# EasyEDA Pro project VFD-BOE1002B-PY32_LCEDA-PRO.epro

# Schematic Schematic1

## Sheets
1 VFD-Driver: Create Date: 2024-07-08; Page Name: VFD-Driver; Project Name: VFD-BOE1002B-PY32; Schematic Name: Schematic1; Update Date: 2024-07-08; Company: 嘉立创EDA; Page Size: A4; Version: V1.0
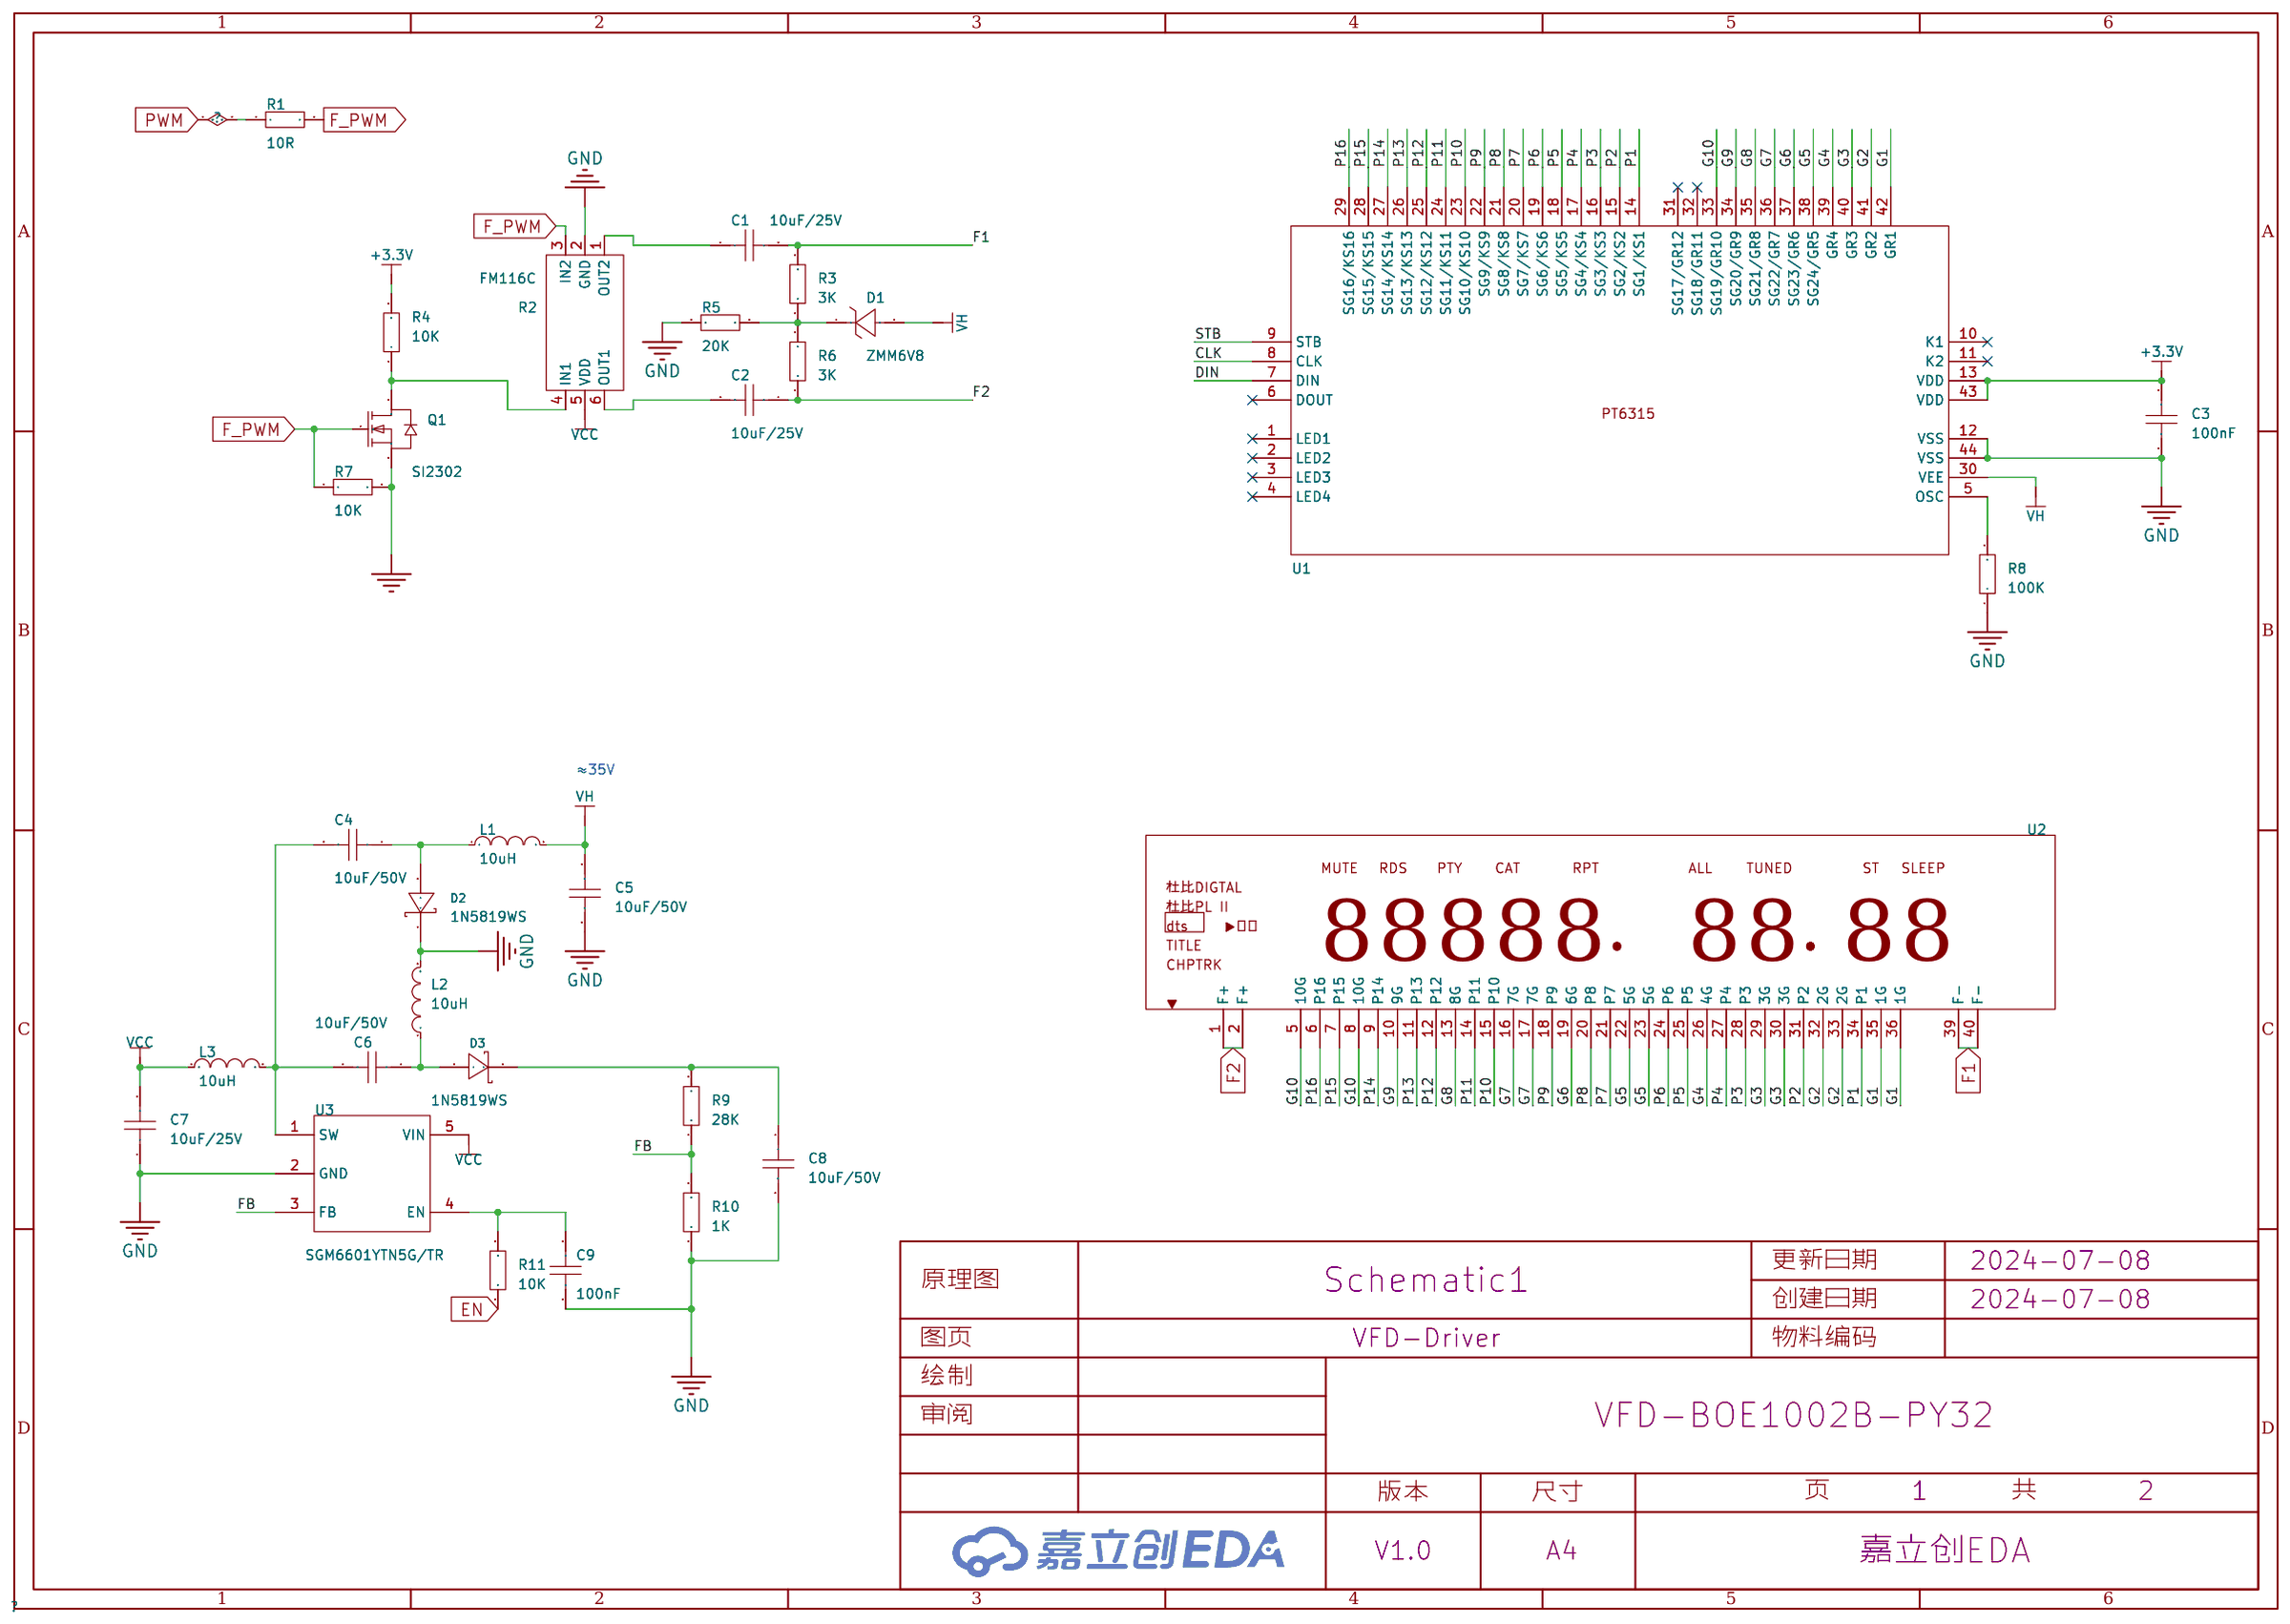
[diagram p0: VFD-Driver]
2 MCU: Page Name: MCU
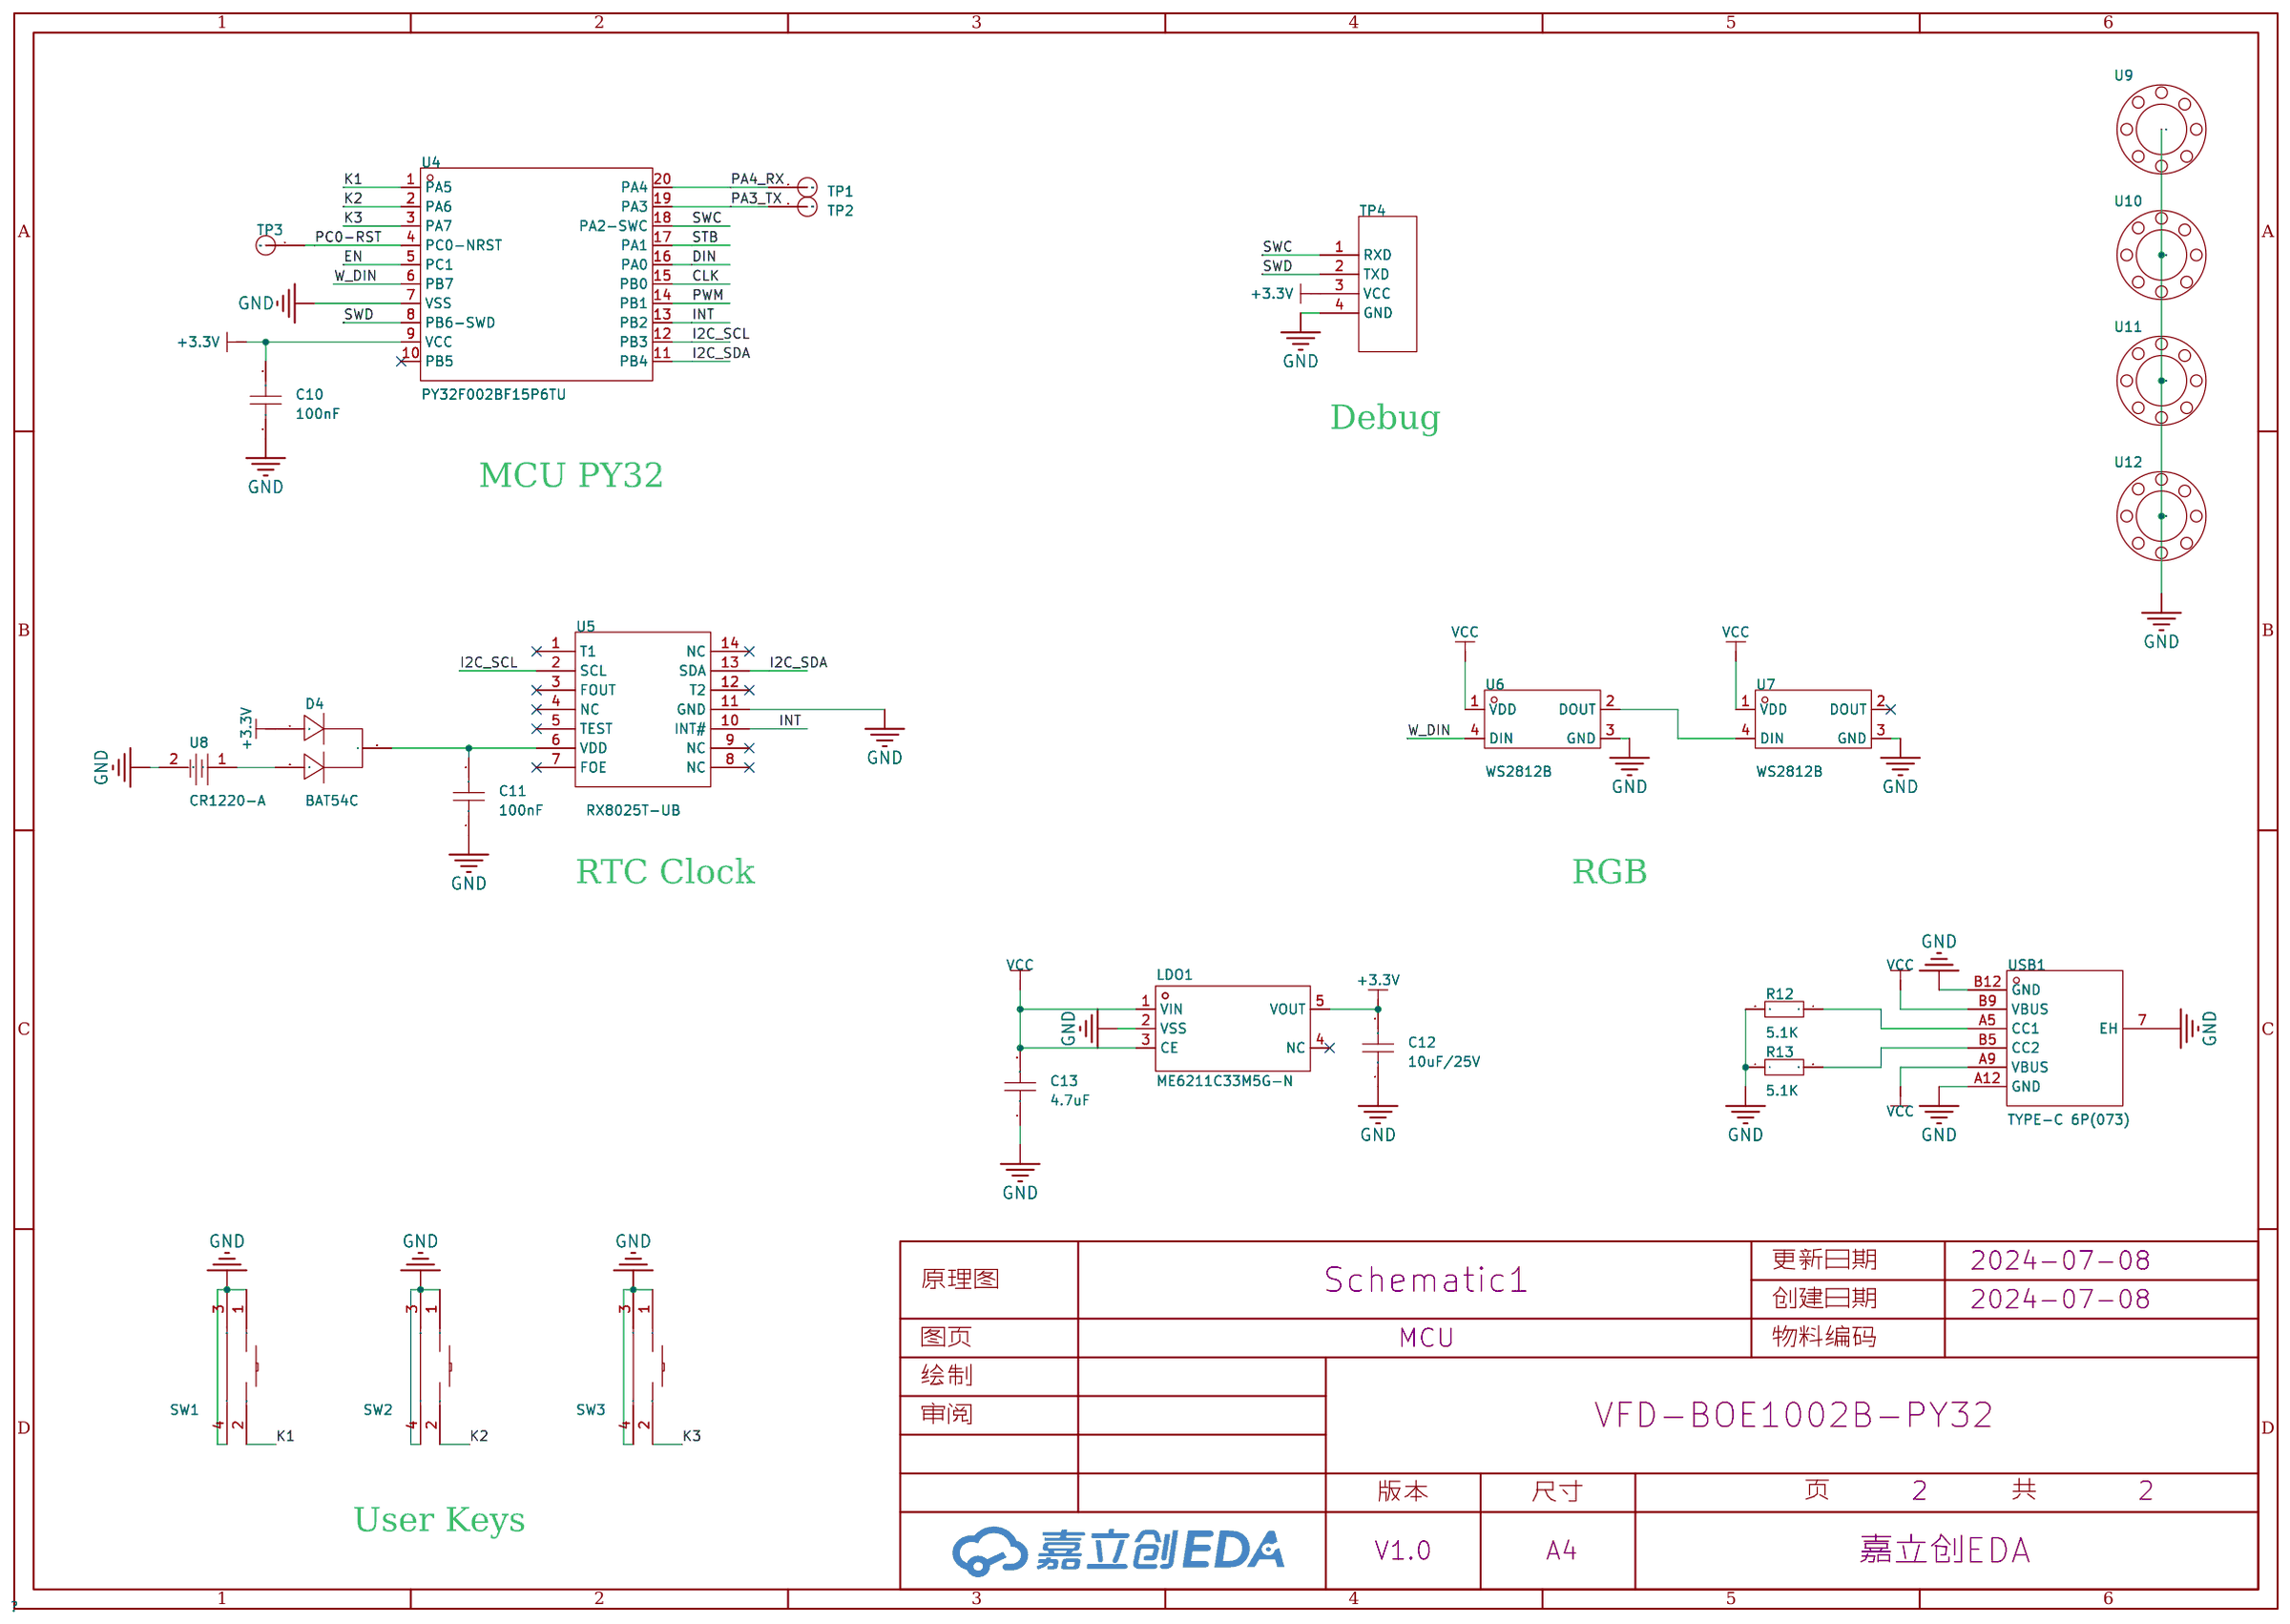
[diagram p1: MCU]

## Parts
sheet MCU
C10  100nF  [C0603]
C11  100nF  [C0603]
C12  10uF/25V  [C0805]
C13  4.7uF  [C0805]
D4  BAT54C  [SOT-23-3_L2.9-W1.3-P1.90-LS2.4-BR]
LDO1  ME6211C33M5G-N  [SOT-23-5_L3.0-W1.7-P0.95-LS2.8-BL]
R12  5.1K  [R0603]
R13  5.1K  [R0603]
SW1  K2-1806SA-A3DW-04  [KEY-SMD_K2-1806SA-AXXW-XX]
SW2  K2-1806SA-A3DW-04  [KEY-SMD_K2-1806SA-AXXW-XX]
SW3  K2-1806SA-A3DW-04  [KEY-SMD_K2-1806SA-AXXW-XX]
TP1  测试点  [TESTPAD]
TP2  测试点  [TESTPAD]
TP3  测试点  [TESTPAD]
TP4  -  [UART测试点]
U4  PY32F002BF15P6TU  [TSSOP-20_L6.5-W4.4-P0.65-LS6.4-BL]
U5  RX8025T-UB  [SOIC-14_L10.1-W5.0-P1.27-LS7.4-BL]
U6  WS2812B  [LED-SMD_4P-L2.0-W1.8-TL]
U7  WS2812B  [LED-SMD_4P-L2.0-W1.8-TL]
U8  CR1220-A  [BAT-SMD_CR1220-2]
U9  -  [M2螺丝孔]
U10  -  [M2螺丝孔]
U11  -  [M2螺丝孔]
U12  -  [M2螺丝孔]
USB1  TYPE-C 6P(073)  [TYPE-C-SMD_TYPE-C-6P]
sheet VFD-Driver
C1  10uF/25V  [C0805]
C2  10uF/25V  [C0805]
C3  100nF  [C0603]
C4  10uF/50V  [C0805]
C5  10uF/50V  [C0805]
C6  10uF/50V  [C0805]
C7  10uF/25V  [C0805]
C8  10uF/50V  [C0805]
C9  100nF  [C0603]
D1  ZMM6V8  [LL-34_L3.5-W1.5-RD]
D2  1N5819WS  [SOD-323_L1.8-W1.3-LS2.5-RD]
D3  1N5819WS  [SOD-323_L1.8-W1.3-LS2.5-RD]
L1  10uH  [IND-SMD_L3.0-W3.0-1]
L2  10uH  [IND-SMD_L3.0-W3.0-1]
L3  10uH  [IND-SMD_L3.0-W3.0-1]
Q1  SI2302  [SOT-23-3_L2.9-W1.3-P1.90-LS2.4-BR]
R1  10R  [R0603]
R2  FM116C  [SOT-23-6_L2.9-W1.6-P0.95-LS2.9-BL]
R3  3K  [R0603]
R4  10K  [R0603]
R5  20K  [R0603]
R6  3K  [R0603]
R7  10K  [R0603]
R8  100K  [R0603]
R9  28K  [R0603]
R10  1K  [R0603]
R11  10K  [R0603]
U1  -  [LQFP-PT6315]
U2  -  [BOE-VFD16-1002B]
U3  SGM6601YTN5G/TR  [SOT-23-5_L3.0-W1.7-P0.95-LS2.8-BR]

## Library data of the parts
C3 C9-C11 = CAP_0603: Supplier Footprint: 0603
C1 C2 C4-C8 C12 C13 = CAP_0805: Supplier Footprint: 0805
D4 = BAT54C: Supplier Part: C9900013520; Supplier Footprint: SOT-23; JLCPCB Part Class: 扩展库; Supplier: LCSC
LDO1 = ME6211C33M5G-N: 输出类型:固定;输出极性:正;最大输入电压:6V;输出电压:3.3V;输出电流:500mA;电源纹波抑制比(PSRR):70dB;; Supplier Part: C82942; Manufacturer: MICRONE(南京微盟); Supplier Footprint: SOT-23-5; JLCPCB Part Class: 扩展库; Datasheet: https://atta.szlcsc.com/upload/public/pdf/source/20170918/C82942_1505727073070976520.pdf; Supplier: LCSC; Output Type: 固定; Maximum Input Voltage: 6V; Output Voltage: 3.3V; MAX Output Current: 500mA; Power Supply Rejection Ratio (PSRR): 70dB; Dropout Voltage: 260mV@(200mA); Output Polarity: 正; Number of Outputs: 1; Output Current: 500mA
R1 R3-R13 = Res_0603: Supplier Footprint: 0603
SW1-SW3 = K2-1806SA-A3DW-04: 触点电流:50mA;额定电压(DC):12V;绝缘电阻:100MΩ;安装方式:卧贴;作用力:180gf@±30gf;机械寿命:100000;工作温度:-25℃~+85℃;开关长度:4.8mm;开关宽度:3.55mm;开关高度:1.88mm;; LCSC Part Name: 2x4 小型侧按键 160G; Supplier Part: C2690015; Manufacturer: 韩国韩荣; Supplier Footprint: SMD; JLCPCB Part Class: 扩展库; Datasheet: https://atta.szlcsc.com/upload/public/pdf/source/20201126/C961746_BE85072586CFEF659A466A854D742287.pdf; Supplier: LCSC; Contact Current: 50mA; Voltage Rating (DC): 12V; Insulation Resistance: 100MΩ; Mounting Sytle: 卧贴; Operating Force: 180gf@±30gf; Mechanical Life: 100000; Operating Temperature: -25℃~+85℃; Switch Length: 4.8mm; Switch Width: 3.55mm; Switch Height: 1.88mm
TP1-TP3 = 测试点
TP4 = UART测试点
U4 = PY32F002BF15P6TU: Supplier Part: C7469098; Manufacturer: PUYA(普冉); Supplier Footprint: TSSOP-20; JLCPCB Part Class: 扩展库; Datasheet: https://atta.szlcsc.com/upload/public/pdf/source/20230721/558A839BF110561168DB9B6F0054F7DC.pdf; Supplier: LCSC
U5 = RX8025T-UB: 接口:I2C;工作电压:1.8V~5.5V;; LCSC Part Name: RX8025T-UB(X1B000281000400); Supplier Part: C17353; Manufacturer: EPSON(爱普生); Supplier Footprint: SOP-14-208mil; JLCPCB Part Class: 扩展库; Datasheet: https://atta.szlcsc.com/upload/public/pdf/source/20220803/150C0D1072734F0C199E626251B601D2.pdf; Supplier: LCSC; Interface: I2C; Operating Voltage: 1.8V~5.5V
U6 U7 = WS2812B: Supplier Part: C9900011976; Supplier Footprint: SMD-0807; JLCPCB Part Class: 扩展库; Supplier: LCSC
U8 = CR1220-A: Supplier Part: C9900016718; Supplier Footprint: SMD-2P; JLCPCB Part Class: 扩展库; Supplier: LCSC
U9-U12 = M2螺丝孔: _: 3
USB1 = TYPE-C 6P(073): 连接器类型:Type-C;标准:-;公母:母;端口数量:1;触点数量:6P;安装方式:卧贴;额定电流 - 电源:5A;工作温度范围:-25℃~+85℃;; LCSC Part Name: Type-C 母 卧贴; Supplier Part: C668623; Manufacturer: SHOU HAN(首韩); Supplier Footprint: SMD; JLCPCB Part Class: 扩展库; Datasheet: https://atta.szlcsc.com/upload/public/pdf/source/20200618/C668623_A4B260DED7AC1949BAC6AE39E9F4CD80.pdf; Supplier: LCSC; Connector Type: Type-C; Gender: 母; Number of Ports: 1; Number of Contacts: 6P; Mounting Style: 卧贴; Current Rating - Power (Max): 5A; Operating Temperature Range: -25℃~+85℃
D1 = ZMM6V8: 稳压值(标称值):-;精度:-;功率:500mW;反向电流(Ir):100nA@3V;; LCSC Part Name: 500mW; Supplier Part: C707197; Manufacturer: Slkor(萨科微); Supplier Footprint: LL-34; JLCPCB Part Class: 扩展库; Datasheet: https://atta.szlcsc.com/upload/public/pdf/source/20200721/C707184_776B95022AAA01ECB528B9CFDAFDB27C.pdf; Supplier: LCSC; Power Dissipation: 500mW; Reverse Leakage Current (Ir): 100nA@3V
D2 D3 = 1N5819WS_C191023: 直流反向耐压(Vr):40V;平均整流电流(Io):1A;正向压降(Vf):600mV@1A;; LCSC Part Name: 40V 1A 600mV@1A; Supplier Part: C191023; Manufacturer: Hottech(合科泰); Supplier Footprint: SOD-323; JLCPCB Part Class: 基础库; Datasheet: https://atta.szlcsc.com/upload/public/pdf/source/20220428/3CB86FD8D28D653594B4E35F9D5AEFD9.pdf; Supplier: LCSC; Reverse Voltage (Vr): 40V; Average Rectified Current (Io): 1A; Forward Voltage (Vf@If): 600mV@1A
L1-L3 = YNR3015-100M: 电感值:10uH;精度:±20%;额定电流:720mA;; LCSC Part Name: 10uH ±20% 720mA 250mΩ; Supplier Part: C340363; Manufacturer: YJYCOIN(益嘉源); Supplier Footprint: SMD,3x3x1.5mm; JLCPCB Part Class: 扩展库; Datasheet: https://atta.szlcsc.com/upload/public/pdf/source/20200623/C340358_C27839FA2B30CE868341344736623AD1.pdf; Supplier: LCSC; Tolerance: ±20%; Rated Current: 720mA; DC Resistance (DCR): 250mΩ
Q1 = SI2302: 类型:N沟道;漏源电压(Vdss):20V;连续漏极电流(Id):2.6A;功率(Pd):900mW;导通电阻(RDS(on)@Vgs,Id):85mΩ@4.5V,2.6A;阈值电压(Vgs(th)@Id):1.5V@250uA;栅极电荷(Qg@Vgs):-;输入电容(Ciss@Vds):880pF@6V;反向传输电容(Crss@Vds):-;工作温度:+150℃@(Tj);; LCSC Part Name: N沟道 20V 2.6A; Supplier Part: C2841377; Manufacturer: TECH PUBLIC(台舟); Supplier Footprint: SOT-23-3; JLCPCB Part Class: 扩展库; Datasheet: https://atta.szlcsc.com/upload/public/pdf/source/20210810/B45106B571BB908B9120BCB1C1283335.pdf; Supplier: LCSC; Type: N沟道; Drain Source Voltage (Vdss): 20V; Continuous Drain Current (Id): 2.6A; Power Dissipation (Pd): 900mW; Drain Source On Resistance (RDS(on)@Vgs,Id): 85mΩ@4.5V,2.6A; Gate Threshold Voltage (Vgs(th)@Id): 1.5V@250uA; Input Capacitance (Ciss@Vds): 880pF@6V; Operating Temperature: +150℃@(Tj)
R2 = FM116C: Supplier Part: C2802264; Manufacturer: FM(富满); Supplier Footprint: SOT-23-6; JLCPCB Part Class: 扩展库; Datasheet: https://atta.szlcsc.com/upload/public/pdf/source/20210409/C2802264_450FE4C4150541706D06339CE4C8D159.pdf; Supplier: LCSC
U1 = PT6315
U2 = BOE-VFD16-1002B: VFD屏幕(DesignBy Saisaiwa)
U3 = SGM6601YTN5G/TR: 功能类型:升压型;同步整流:-;输出通道数:1;拓扑结构:升压式;输入电压:1.8V~6V;输出电压:38V;输出电流(最大值):400mA;开关频率:1MHz;; LCSC Part Name: 升压型 Vin=1.8V~6V Vout=38V 400mA; Supplier Part: C84574; Manufacturer: SGMICRO(圣邦微); Supplier Footprint: SOT-23-5; JLCPCB Part Class: 扩展库; Datasheet: https://atta.szlcsc.com/upload/public/pdf/source/20170510/1494407693659.pdf; Supplier: LCSC; Function: 升压型; Number of Outputs: 1; Topology: 升压式; Input Voltage: 1.8V~6V; Output Voltage: 38V; Output Current (Max): 400mA; Switching Frequency: 1MHz

## Nets
+3.3V: C3.2 C10.2 C12.2 D4.1(A1) LDO1.5(VOUT) R4.2 TP4.3(VCC) U1.13(VDD) U1.43(VDD) U4.9(VCC)
GND: C3.1 C5.2 C7.1 C8.2 C9.1 C10.1 C11.1 C12.1 C13.1 D2.1(K) L2.2 LDO1.2(VSS) Q1.2(S) R2.2(GND) R5.1 R7.2 R8.1 R10.1 R12.2 R13.1 SW1.1 SW1.3 SW1.4 SW2.1 SW2.3 SW2.4 SW3.1 SW3.3 SW3.4 TP4.4(GND) U1.12(VSS) U1.44(VSS) U3.2(GND) U4.7(VSS) U5.11(GND) U6.3(GND) U7.3(GND) U8.2 U9.1 U10.1 U11.1 U12.1 USB1.7(EH) USB1.A12(GND) USB1.B12(GND)
VCC: C7.2 C13.2 L3.1 LDO1.1(VIN) LDO1.3(CE) R2.5(VDD) U3.5(VIN) U6.1(VDD) U7.1(VDD) USB1.A9(VBUS) USB1.B9(VBUS)
CLK: U1.8(CLK) U4.15(PB0)
DIN: U1.7(DIN) U4.16(PA0)
EN: R11.1 U4.5(PC1)
F1: C1.2 R3.2 U2.39(F-) U2.40(F-)
F2: C2.1 R6.1 U2.1(F+) U2.2(F+)
F_PWM: Q1.1(G) R1.2 R2.3(IN2) R7.1
FB: R9.1 R10.2 U3.3(FB)
G1: U1.42(GR1) U2.35(1G) U2.36(1G)
G2: U1.41(GR2) U2.32(2G) U2.33(2G)
G3: U1.40(GR3) U2.29(3G) U2.30(3G)
G4: U1.39(GR4) U2.26(4G)
G5: U1.38(SG24/GR5) U2.22(5G) U2.23(5G)
G6: U1.37(SG23/GR6) U2.19(6G)
G7: U1.36(SG22/GR7) U2.16(7G) U2.17(7G)
G8: U1.35(SG21/GR8) U2.13(8G)
G9: U1.34(SG20/GR9) U2.10(9G)
G10: U1.33(SG19/GR10) U2.5(10G) U2.8(10G)
I2C_SCL: U4.12(PB3) U5.2(SCL)
I2C_SDA: U4.11(PB4) U5.13(SDA)
INT: U4.13(PB2) U5.10(INT#)
K1: SW1.2 U4.1(PA5)
K2: SW2.2 U4.2(PA6)
K3: SW3.2 U4.3(PA7)
P1: U1.14(SG1/KS1) U2.34(P1)
P2: U1.15(SG2/KS2) U2.31(P2)
P3: U1.16(SG3/KS3) U2.28(P3)
P4: U1.17(SG4/KS4) U2.27(P4)
P5: U1.18(SG5/KS5) U2.25(P5)
P6: U1.19(SG6/KS6) U2.24(P6)
P7: U1.20(SG7/KS7) U2.21(P7)
P8: U1.21(SG8/KS8) U2.20(P8)
P9: U1.22(SG9/KS9) U2.18(P9)
P10: U1.23(SG10/KS10) U2.15(P10)
P11: U1.24(SG11/KS11) U2.14(P11)
P12: U1.25(SG12/KS12) U2.12(P12)
P13: U1.26(SG13/KS13) U2.11(P13)
P14: U1.27(SG14/KS14) U2.9(P14)
P15: U1.28(SG15/KS15) U2.7(P15)
P16: U1.29(SG16/KS16) U2.6(P16)
PA3_TX: TP2.1(TESTPAD) U4.19(PA3)
PA4_RX: TP1.1(TESTPAD) U4.20(PA4)
PC0-RST: TP3.1(TESTPAD) U4.4(PC0-NRST)
PWM: R1.1 U4.14(PB1)
STB: U1.9(STB) U4.17(PA1)
SWC: TP4.1(RXD) U4.18(PA2-SWC)
SWD: TP4.2(TXD) U4.8(PB6-SWD)
VH: C5.1 D1.2(A) L1.2 U1.30(VEE)
W_DIN: U4.6(PB7) U6.4(DIN)
$1N1295: R8.2 U1.5(OSC)
$1N1298: D1.1(K) R3.1 R5.2 R6.2
$1N1304: C1.1 R2.1(OUT2)
$1N1305: C2.2 R2.6(OUT1)
$1N1312: Q1.3(D) R2.4(IN1) R4.1
$1N1316: C6.1 D3.2(A) L2.1
$1N1320: C4.1 D2.2(A) L1.1
$1N1321: C4.2 C6.2 L3.2 U3.1(SW)
$1N1324: C8.1 D3.1(K) R9.2
$1N1595: C9.2 R11.2 U3.4(EN)
$2N726: R12.1 USB1.A5(CC1)
$2N727: R13.2 USB1.B5(CC2)
$2N1396: C11.2 D4.3(K) U5.6(VDD)
$2N1397: D4.2(A2) U8.1
$2N1576: U6.2(DOUT) U7.4(DIN)

Not connected (* = marked no-connect by the designer): LDO1 4(NC)*; U1 1(LED1)* 2(LED2)* 3(LED3)* 4(LED4)* 6(DOUT)* 10(K1)* 11(K2)* 31(SG17/GR12)* 32(SG18/GR11)*; U4 10(PB5)*; U5 1(T1)* 3(FOUT)* 4(NC)* 5(TEST)* 7(FOE)* 8(NC)* 9(NC)* 12(T2)* 14(NC)*; U7 2(DOUT)*

## Notes on the sheets
sheet 1
- ≈35V
sheet 2
- Debug
- MCU PY32
- RTC Clock
- RGB
- User Keys

# Board PCB1
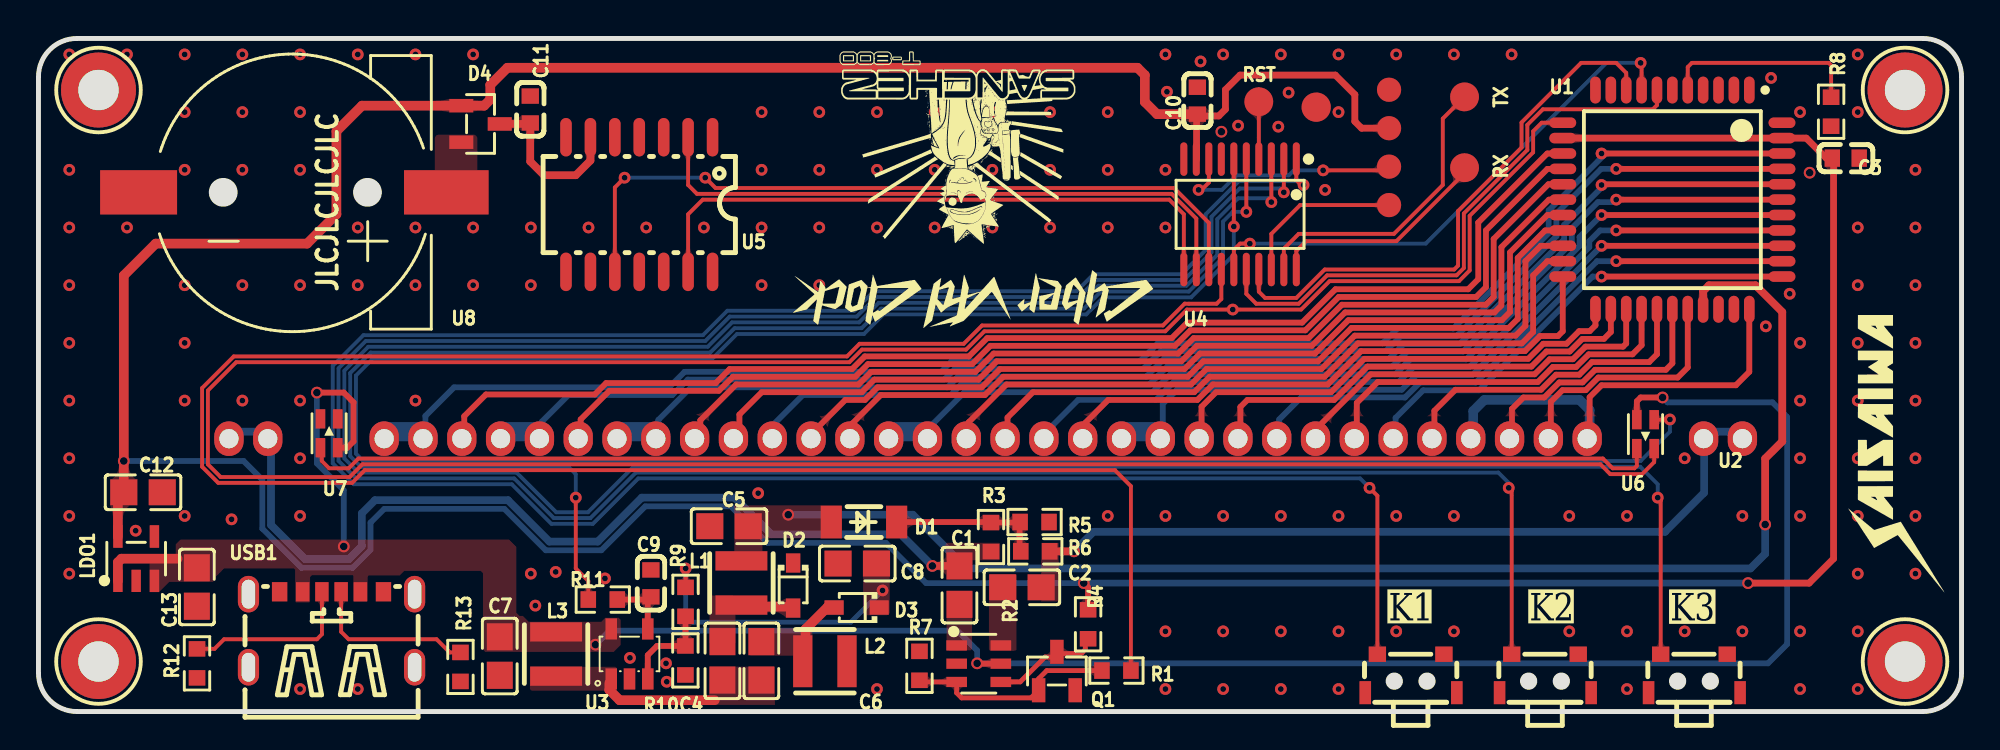
[diagram p2: board, top side]
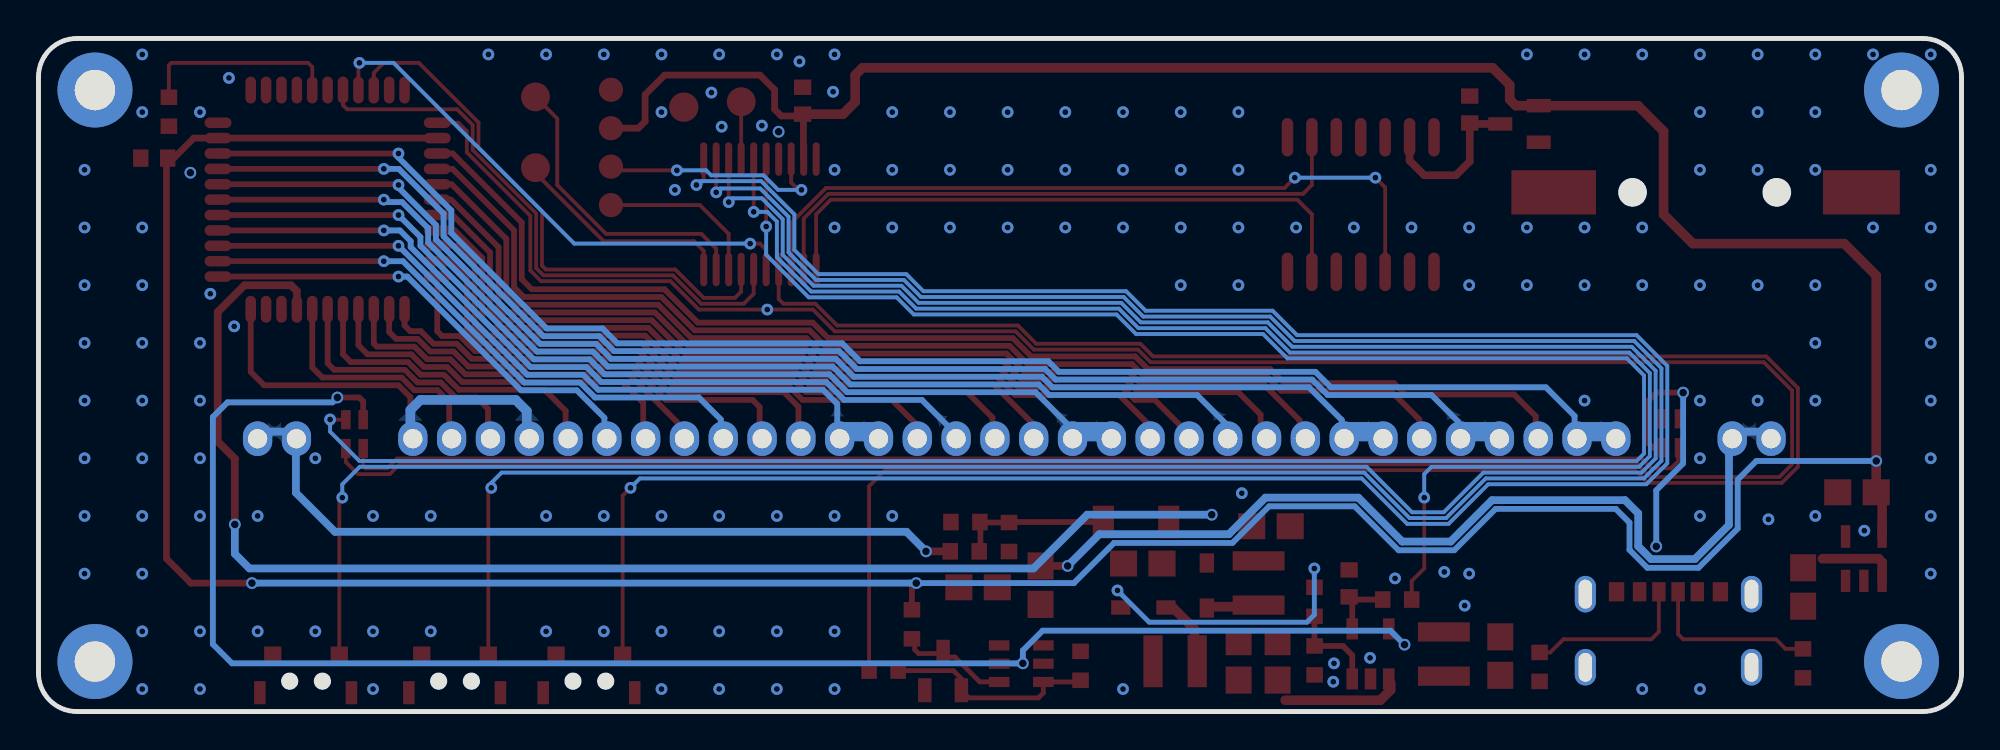
[diagram p3: board, bottom side, seen from below]

Outline 100 x 35 mm; copper layers: Top Layer, Bottom Layer. Coordinates in mm from the lower left corner of the outline.
Outline path: 0,33 0,2 arc(0.59,0.59) 2,0 98,0 arc(99.41,0.59) 100,2 100,33 arc(99.41,34.41) 98,35 2,35 arc(0.59,34.41) 0,33
Stack: Top Layer 0.035mm / Dielectric1 1.51mm FR4 er 4.5 / Bottom Layer 0.035mm

## Design rules (mm)
template: 自定义配置
spacing copperThickness1oz (default): track to track 0.102, other pairs 0.152 to 0.3
spacing copperThickness2oz: track to track 0.203, other pairs 0.152 to 0.3
track width copperThickness1oz (default): min 0.127, default 0.254, max 2.54
track width copperThickness2oz: min 0.203, default 0.254, max 2.54
differential pair differentialPair (default): width min 0.127, default 0.254, max 2.54; gap min 0.152, default 0.152
via viaSize (default): diameter min 0.5, default 0.61, max 10; hole min 0.3, default 0.305, max 6.3

## Placement (name value [footprint] x y rotation side)
C1  10uF/25V  [C0805]  47.89 6.57 90 top
C2  10uF/25V  [C0805]  51.14 6.46 180 top
C3  100nF  [C0603]  93.98 28.78 180 top
C4  10uF/50V  [C0805]  35.57 2.64 270 top
C5  10uF/50V  [C0805]  35.91 9.64 180 top
C6  10uF/50V  [C0805]  37.59 2.64 270 top
C7  10uF/25V  [C0805]  23.99 2.89 90 top
C8  10uF/50V  [C0805]  42.58 7.7 180 top
C9  100nF  [C0603]  31.85 6.66 270 top
C10  100nF  [C0603]  60.26 31.76 270 top
C11  100nF  [C0603]  25.57 31.31 270 top
C12  10uF/25V  [C0805]  5.44 11.4 180 top
C13  4.7uF  [C0805]  8.24 6.48 90 top
D1  ZMM6V8  [LL-34_L3.5-W1.5-RD]  42.93 9.85 180 top
D2  1N5819WS  [SOD-323_L1.8-W1.3-LS2.5-RD]  39.24 6.55 270 top
D3  1N5819WS  [SOD-323_L1.8-W1.3-LS2.5-RD]  42.54 5.41 180 top
D4  BAT54C  [SOT-23-3_L2.9-W1.3-P1.90-LS2.4-BR]  22.99 30.56 180 top
L1  10uH  [IND-SMD_L3.0-W3.0-1]  36.55 6.69 90 top
L2  10uH  [IND-SMD_L3.0-W3.0-1]  40.89 2.62 0 top
L3  10uH  [IND-SMD_L3.0-W3.0-1]  26.92 2.99 270 top
LDO1  ME6211C33M5G-N  [SOT-23-5_L3.0-W1.7-P0.95-LS2.8-BL]  5.08 7.95 0 top
NOREF  -  [Pad_e9737]  66.44 31.43 0 top
Q1  SI2302  [SOT-23-3_L2.9-W1.3-P1.90-LS2.4-BR]  52.96 2.11 270 top
R1  10R  [R0603]  56.05 2.13 180 top
R2  FM116C  [SOT-23-6_L2.9-W1.6-P0.95-LS2.9-BL]  48.9 2.49 270 top
R3  3K  [R0603]  49.53 9.07 270 top
R4  10K  [R0603]  54.58 4.54 90 top
R5  20K  [R0603]  51.8 9.85 180 top
R6  3K  [R0603]  51.83 8.33 180 top
R7  10K  [R0603]  45.81 2.38 90 top
R8  100K  [R0603]  93.22 31.19 90 top
R9  28K  [R0603]  33.65 5.7 90 top
R10  1K  [R0603]  33.64 2.66 90 top
R11  10K  [R0603]  29.34 5.82 0 top
R12  5.1K  [R0603]  8.25 2.51 270 top
R13  5.1K  [R0603]  21.94 2.32 90 top
RST  测试点  [TESTPAD]  63.46 31.71 0 top
RX  测试点  [TESTPAD]  74.16 28.28 0 top
SW1  K2-1806SA-A3DW-04  [KEY-SMD_K2-1806SA-AXXW-XX]  71.37 1.98 180 top
SW2  K2-1806SA-A3DW-04  [KEY-SMD_K2-1806SA-AXXW-XX]  78.36 1.98 180 top
SW3  K2-1806SA-A3DW-04  [KEY-SMD_K2-1806SA-AXXW-XX]  86.11 1.98 180 top
TP4  -  [UART测试点]  70.23 29.16 90 top
TX  测试点  [TESTPAD]  74.16 31.96 0 top
U1  -  [LQFP-PT6315]  84.96 26.62 270 top
U2  -  [BOE-VFD16-1002B]  52.58 14.68 180 top
U3  SGM6601YTN5G/TR  [SOT-23-5_L3.0-W1.7-P0.95-LS2.8-BR]  30.73 3 270 top
U4  PY32F002BF15P6TU  [TSSOP-20_L6.5-W4.4-P0.65-LS6.4-BL]  62.48 25.86 180 top
U5  RX8025T-UB  [SOIC-14_L10.1-W5.0-P1.27-LS7.4-BL]  31.24 26.36 180 top
U6  WS2812B  [LED-SMD_4P-L2.0-W1.8-TL]  83.57 14.43 90 top
U7  WS2812B  [LED-SMD_4P-L2.0-W1.8-TL]  15.11 14.47 270 top
U8  CR1220-A  [BAT-SMD_CR1220-2]  13.21 27 180 top
U9  -  [M2螺丝孔]  97.06 32.32 0 top
U10  -  [M2螺丝孔]  97.06 2.6 0 top
U11  -  [M2螺丝孔]  3.12 2.6 0 top
U12  -  [M2螺丝孔]  3.12 32.32 0 top
USB1  TYPE-C 6P(073)  [TYPE-C-SMD_TYPE-C-6P]  15.24 4.27 0 top

## Footprints (pads in the part's own frame, mm; a bottom-side part is the same pattern mirrored in y, then rotated)
BAT-SMD_CR1220-2
  rect 4.4x2.3 smd: 1(-8,0)
  rect 4x2.3 smd: 2(8,0)
BOE-VFD16-1002B
  oval 1.524x1.8 hole 1: 1(-36.027,0.491) 2(-34.009,0.491) 5(-27.956,0.491) 6(-25.938,0.491) 7(-23.919,0.491) 8(-21.901,0.491) 9(-19.884,0.491) 10(-17.866,0.491) 11(-15.848,0.491) 12(-13.83,0.491) 13(-11.812,0.491) 14(-9.794,0.491) 15(-7.776,0.491) 16(-5.758,0.491) 17(-3.74,0.491) 18(-1.722,0.491) 19(0.295,0.491) 20(2.313,0.491) 21(4.332,0.491) 22(6.349,0.491) 23(8.367,0.491) 24(10.385,0.491) 25(12.403,0.491) 26(14.421,0.491) 27(16.439,0.491) 28(18.457,0.491) 29(20.475,0.491) 30(22.493,0.491) 31(24.511,0.491) 32(26.529,0.491) 33(28.547,0.491) 34(30.564,0.491) 35(32.583,0.491) 36(34.6,0.491) 39(40.654,0.491) 40(42.672,0.491)
C0603
  rect 0.8x0.9 smd: 1(-0.7,0) 2(0.7,0)
C0805
  rect 1.41x1.35 smd: 1(-1,0) 2(1,0)
IND-SMD_L3.0-W3.0-1
  rect 1x2.7 smd: 1(-1.15,0) 2(1.15,0)
KEY-SMD_K2-1806SA-AXXW-XX
  rect 0.9x0.8 smd: 1(-1.71,-1) 2(1.75,-1)
  rect 0.6x1.2 smd: 3(-2.38,1) 4(2.38,1)
LED-SMD_4P-L2.0-W1.8-TL
  rect 1x0.5 smd: 1(0.75,0.45) 2(-0.75,0.45) 3(-0.75,-0.45) 4(0.75,-0.45)
LL-34_L3.5-W1.5-RD
  rect 1.1x1.7 smd: 1(-1.7,0) 2(1.7,0)
LQFP-PT6315
  oval 1.4x0.55 smd: 1(-5.7,4) 2(-5.7,3.2) 3(-5.7,2.4) 4(-5.7,1.6) 5(-5.7,0.8) 6(-5.7,0) 7(-5.7,-0.8) 8(-5.7,-1.6) 9(-5.7,-2.4) 10(-5.7,-3.2) 11(-5.7,-4) 23(5.7,-4) 24(5.7,-3.2) 25(5.7,-2.4) 26(5.7,-1.6) 27(5.7,-0.8) 28(5.7,0) 29(5.7,0.8) 30(5.7,1.6) 31(5.7,2.4) 32(5.7,3.2) 33(5.7,4)
  oval 0.55x1.4 smd: 12(-4,-5.7) 13(-3.2,-5.7) 14(-2.4,-5.7) 15(-1.6,-5.7) 16(-0.8,-5.7) 17(0,-5.7) 18(0.8,-5.7) 19(1.6,-5.7) 20(2.4,-5.7) 21(3.2,-5.7) 22(4,-5.7) 34(4,5.7) 35(3.2,5.7) 36(2.4,5.7) 37(1.6,5.7) 38(0.8,5.7) 39(0,5.7) 40(-0.8,5.7) 41(-1.6,5.7) 42(-2.4,5.7) 43(-3.2,5.7) 44(-4,5.7)
M2螺丝孔
  round 3.9 hole 2.1: 1(0,0)
Pad_e9737
  round 1.524 smd: 45(0,0)
R0603
  rect 0.806x0.864 smd: 1(-0.753,0) 2(0.753,0)
SOD-323_L1.8-W1.3-LS2.5-RD
  rect 1x0.75 smd: 1(-1.173,0) 2(1.173,0)
SOIC-14_L10.1-W5.0-P1.27-LS7.4-BL
  oval 0.6x2 smd: 1(-3.81,-3.5) 2(-2.54,-3.5) 3(-1.27,-3.5) 4(0,-3.5) 5(1.27,-3.5) 6(2.54,-3.5) 7(3.81,-3.5) 8(3.81,3.5) 9(2.54,3.5) 10(1.27,3.5) 11(0,3.5) 12(-1.27,3.5) 13(-2.54,3.5) 14(-3.81,3.5)
SOT-23-3_L2.9-W1.3-P1.90-LS2.4-BR
  rect 1.25x0.7 smd: 1(1,-0.95) 2(1,0.95) 3(-1,0)
SOT-23-5_L3.0-W1.7-P0.95-LS2.8-BL
  rect 0.49x1.157 smd: 1(-0.95,-1.153) 2(0,-1.153) 3(0.95,-1.153)
  rect 0.49x1.175 smd: 4(0.95,1.153) 5(-0.95,1.153)
SOT-23-5_L3.0-W1.7-P0.95-LS2.8-BR
  rect 1.1x0.6 smd: 1(1.3,-0.95) 2(1.3,0) 3(1.3,0.95) 4(-1.3,0.95) 5(-1.3,-0.95)
SOT-23-6_L2.9-W1.6-P0.95-LS2.9-BL
  rect 0.532x1.072 smd: 1(-0.95,-1.149) 2(0,-1.149) 3(0.95,-1.149) 4(0.95,1.149) 5(0,1.149) 6(-0.95,1.149)
TESTPAD
  round 1.5 smd: 1(0,-0.001)
TSSOP-20_L6.5-W4.4-P0.65-LS6.4-BL
  oval 0.364x1.742 smd: 1(-2.925,-2.871) 2(-2.275,-2.871) 3(-1.625,-2.871) 4(-0.975,-2.871) 5(-0.325,-2.871) 6(0.325,-2.871) 7(0.975,-2.871) 8(1.625,-2.871) 9(2.275,-2.871) 10(2.925,-2.871) 11(2.925,2.871) 12(2.275,2.871) 13(1.625,2.871) 14(0.975,2.871) 15(0.325,2.871) 16(-0.325,2.871) 17(-0.975,2.871) 18(-1.625,2.871) 19(-2.275,2.871) 20(-2.925,2.871)
TYPE-C-SMD_TYPE-C-6P
  oval 1.1x1.9 hole 0.7x1.5: 7(-4.32,1.837) 7(-4.32,-1.962) 7(4.32,1.837) 7(4.32,-1.962)
  rect 0.7x1 smd: A5(-0.5,1.962) A9(1.5,1.962) B5(0.5,1.962) B9(-1.5,1.962)
  rect 0.8x1 smd: A12(2.7,1.962) B12(-2.7,1.962)
UART测试点
  round 1.26 smd: 1(-2.822,0) 2(-0.823,0) 3(1.176,0) 4(3.175,0)

## Nets
As in the schematic, except:
GND: C3.1 C5.2 C7.1 C8.2 C9.1 C10.1 C11.1 C12.1 C13.1 D2.1 L2.2 LDO1.2 NOREF.45 Q1.2 R2.2 R5.1 R7.2 R8.1 R10.1 R12.2 R13.1 SW1.1 SW1.3 SW1.4 SW2.1 SW2.3 SW2.4 SW3.1 SW3.3 SW3.4 TP4.4 U1.12 U1.44 U3.2 U4.7 U5.11 U6.3 U7.3 U8.2 U9.1 U10.1 U11.1 U12.1 USB1.7 USB1.A12 USB1.B12
PA3_TX: TX.1 U4.19
PA4_RX: RX.1 U4.20
PC0-RST: RST.1 U4.4

Pads without a net: LDO1 4; U1 1 2 3 4 6 10 11 31 32; U4 10; U5 1 3 4 5 7 8 9 12 14; U7 2

## Via types
v1: diameter 0.61, hole 0.305, Top Layer to Bottom Layer, 42 vias
v2: diameter 0.61, hole 0.304, Top Layer to Bottom Layer, 134 vias
v3: diameter 0.61, hole 0.4, Top Layer to Bottom Layer, 14 vias
v4: diameter 0.61, hole 0.3, Top Layer to Bottom Layer, 4 vias

## Routing (per net, layer and track width the routed paths; a pad name or vN(x,y) marks a point on that pad's centre or on a via; arc(x,y) is an arc through that point)
+3.3V: length 230.1
  Top Layer w0.3: R4.2 54.58,6.45 v3(54.36,6.68)
  Top Layer w0.35: 60.22,28.73 60.22,30.92 60.27,30.97 61.38,30.97 61.72,31.32 61.72,32.33 62.48,33.09 67.44,33.09 68.45,32.08 68.45,30.68 68.8,30.33 TP4.3 ; 79.26,29.82 91.92,29.82 92.96,28.78 C3.2 93.34,28.71 93.34,7.95 92.07,6.68 v3(88.9,6.68)
  Top Layer w0.5: C10.2 58.17,31.06 57.53,31.7 57.53,33.09 57.15,33.48 24.38,33.48 23.5,32.59 23.5,31.83 23.17,31.51 D4.1 16.83,31.51 15.49,30.17 15.49,25.86 13.97,24.33 6.1,24.33 4.44,22.67 v3(4.44,13.03) C12.2 4.13,11.09 LDO1.5
  Bottom Layer w0.3: v3(54.36,6.68) 46.16,6.68 44.07,8.77 37.91,8.77 36.01,10.67 31.56,10.67 29.27,8.39 26.38,8.39 24.23,10.54 17.98,10.54 17.27,9.82 17.27,8.41 16.33,7.48 13.68,7.48 11.64,9.51 11.64,12.06 10.67,13.03 v3(4.44,13.03)
  Bottom Layer w0.35: v3(54.36,6.68) v3(88.9,6.68)
GND: length 159.3
  Top Layer w0.2: U1.12 78.17,30.62 77.72,30.17 77.72,29.08 74.42,25.78 74.42,22.94 73.87,22.38 67.14,22.38 65.66,20.9 v1(62.1,20.9) 59.72,20.9 58.59,19.77 49.19,19.77 48.24,18.82 42.82,18.82 42.17,18.16 10.28,18.16 8.81,16.69 8.81,12.85 9.47,12.19 16.18,12.19 16.84,12.85 81.22,12.85 81.73,12.35 83.39,12.35 84.02,12.97 U6.3
  vias: v1(5.05,9.4) v1(10.04,10) v1(25.84,5.51) v1(26.9,7.26) v1(29.46,6.92) v1(30.76,2.79) v1(32.63,2.51) v1(32.67,1.55) v1(58.68,32.23) v1(60.43,33.8) v1(62.38,30.47) v1(64.47,30.41) v1(65.01,32.19) v1(66.91,27.13) v2(1.6,34.17) v2(1.6,28.17) v2(1.6,25.17) v2(1.6,22.17) v2(1.6,19.17) v2(1.6,16.17) v2(1.6,13.17) v2(1.6,10.17) v2(1.6,7.17) v2(4.6,34.17) v2(4.6,25.17) v2(7.6,34.17) v2(7.6,31.17) v2(7.6,28.17) v2(7.6,22.17) v2(7.6,19.17) v2(7.6,16.17) v2(7.6,10.17) v2(10.6,34.17) v2(10.6,31.17) v2(10.6,28.17) v2(10.6,22.17) v2(10.6,16.17) v2(13.6,34.17) v2(13.6,31.17) v2(13.6,28.17) v2(13.6,22.17) v2(13.6,16.17) v2(13.6,13.17) v2(13.6,10.17) v2(13.6,1.17) v2(16.6,34.17) v2(16.6,25.17) v2(16.6,22.17) v2(16.6,1.17) v2(19.6,34.17) v2(19.6,25.17) v2(19.6,22.17) v2(19.6,16.17) v2(22.6,34.17) v2(22.6,25.17) v2(22.6,22.17) v2(25.6,25.17) v2(25.6,22.17) v2(25.6,7.17) v2(28.6,25.17) v2(31.6,25.17) v2(34.6,25.17) v2(37.6,31.17) v2(37.6,28.17) v2(37.6,25.17) v2(37.6,22.17) v2(40.6,31.17) v2(40.6,28.17) v2(40.6,25.17) v2(40.6,22.17) v2(43.6,31.17) v2(43.6,28.17) v2(43.6,25.17) v2(43.6,1.17) v2(46.6,31.17) v2(46.6,28.17) v2(46.6,25.17) v2(49.6,31.17) v2(49.6,28.17) v2(49.6,25.17) v2(52.6,31.17) v2(52.6,28.17) v2(52.6,25.17) v2(55.6,31.17) v2(55.6,28.17) v2(55.6,25.17) v2(55.6,10.17) v2(58.6,34.17) v2(58.6,28.17) v2(58.6,25.17) v2(58.6,10.17) v2(58.6,4.17) v2(58.6,1.17) v2(61.6,34.17) v2(61.6,10.17) v2(61.6,4.17) v2(61.6,1.17) v2(64.6,34.17) v2(64.6,10.17) v2(64.6,4.17) v2(64.6,1.17) v2(67.6,34.17) v2(67.6,31.17) v2(67.6,10.17) v2(67.6,4.17) v2(67.6,1.17) v2(70.6,34.17) v2(70.6,10.17) v2(70.6,4.17) v2(73.6,34.17) v2(73.6,10.17) v2(73.6,4.17) v2(76.6,34.17) v2(79.6,10.17) v2(79.6,4.17) v2(82.6,10.17) v2(82.6,4.17) v2(82.6,1.17) v2(85.6,13.17) v2(85.6,4.17) v2(88.6,10.17) v2(88.6,4.17) v2(91.6,31.17) v2(91.6,19.17) v2(91.6,16.17) v2(91.6,13.17) v2(91.6,10.17) v2(91.6,4.17) v2(91.6,1.17) v2(94.6,34.17) v2(94.6,31.17) v2(94.6,25.17) v2(94.6,22.17) v2(94.6,19.17) v2(94.6,16.17) v2(94.6,13.17) v2(94.6,10.17) v2(94.6,7.17) v2(94.6,4.17) v2(94.6,1.17) v2(97.6,28.17) v2(97.6,25.17) v2(97.6,22.17) v2(97.6,19.17) v2(97.6,16.17) v2(97.6,13.17) v2(97.6,10.17) v2(97.6,7.17) v3(61.51,30.15) v3(92.1,28.02) v4(37.43,11.35) v4(89.82,20.03) v4(90.1,32.95) v4(91.06,21.72)
VCC: length 103.9
  Top Layer w0.3: v3(48.81,2.51) 48.83,2.49 R2.5 ; v3(84.46,16.33) 83.31,16.33 83.12,16.14 U6.1 ; U7.1 16.06,13.72 16.38,14.05 16.38,16.08 15.88,16.59 v3(14.48,16.59)
  Top Layer w0.5: 7.24,7.95 4.32,7.95 4.13,7.76 LDO1.1
  Bottom Layer w0.3: v3(14.48,16.59) 14.48,12.9 15.88,11.51 v3(15.88,8.58) ; v3(84.46,16.33) 84.71,16.08 90.17,16.08 90.93,15.31 90.93,3.5 89.94,2.51 v3(48.81,2.51) 48.81,3.18 47.78,4.2 29.69,4.2 v3(28.96,3.48)
CLK: length 27.6
  Top Layer w0.2: v1(83.31,33.73) 83.36,33.68 83.36,32.32 ; v1(62.99,24.33) 62.48,24.33 62.16,24.01 U4.15
  Bottom Layer w0.2: v1(83.31,33.73) 81.53,33.73 72.14,24.33 v1(62.99,24.33)
DIN: length 30.3
  Top Layer w0.2: U4.16 62.81,21.72 63.32,21.21 65.53,21.21 67.01,22.68 73.74,22.68 74.12,23.06 74.12,25.9 77.42,29.2 77.42,30.51 78.23,31.32 83.95,31.32 84.16,31.53 84.16,32.32
EN: length 77.1
  Top Layer w0.2: R11.1 28.59,6.79 27.94,7.44 v1(27.94,11.12) ; U4.5 v1(62.81,25.98)
  Bottom Layer w0.2: v1(27.94,11.12) 27.94,12.35 27.56,12.73 16.77,12.73 16.21,13.29 16.21,17.6 17.27,18.67 34.93,18.67 36.2,19.94 42.8,19.94 43.82,20.95 54.36,20.95 55.25,21.84 59.82,21.84 61.6,23.62 61.6,25.48 62.1,25.98 v1(62.81,25.98)
F1: length 49
  Top Layer w0.4: C1.2 v3(46.48,7.57)
  Bottom Layer w0.4: v3(46.48,7.57) 44.84,9.22 38.1,9.22 36.19,11.12 31.37,11.12 29.08,8.84 26.57,8.84 24.41,10.99 17.5,10.99 16.81,10.31 16.81,8.59 16.15,7.93 13.87,7.93 12.09,9.7 12.09,14.55 10.07,14.55
F2: length 40.5
  Top Layer w0.4: R6.1 v3(53.85,8.33)
  Bottom Layer w0.4: v3(53.85,8.33) 54.86,9.35 84.58,9.35 86.61,11.38 86.61,14.41 86.75,14.55 88.77,14.55
F_PWM: length 10.9
  Top Layer w0.25: 45.81,1.62 45.9,1.54 R2.3 47.75,0.97 48.01,0.71 51.61,0.71 Q1.1 52.01,1.71 52.43,2.13 55.06,2.13
FB: length 4.9
  Top Layer w0.3: R9.1 33.65,3.42 33.64,3.41 32.16,3.41 31.68,2.93 U3.3
G1: length 79.8
  Top Layer w0.3: 90.66,29.02 v1(81.28,29.02)
  Bottom Layer w0.3: v1(81.28,29.02) 81.28,28.81 78.53,26.06 78.53,24.88 73.57,19.92 70.67,19.92 69.89,19.14 58.2,19.14 57.27,18.21 47.49,18.21 46.94,17.66 33.6,17.66 32.79,16.86 21.61,16.86 20.12,15.37 20.12,14.55
  Bottom Layer w1: 18.1,14.55 20.12,14.55
G2: length 73.2
  Top Layer w0.3: U1.41 v1(82.04,28.22)
  Bottom Layer w0.3: v1(82.04,28.22) 81.26,28.22 78.93,25.89 78.93,24.71 73.74,19.52 70.83,19.52 70.06,18.74 58.37,18.74 57.44,17.81 47.65,17.81 47.1,17.26 33.76,17.26 32.96,16.46 27.56,16.46 26.18,15.08 26.18,14.55
  Bottom Layer w1: 24.16,14.55 26.18,14.55
G3: length 66.7
  Top Layer w0.3: v1(81.28,27.38) 81.32,27.42 U1.40
  Bottom Layer w0.3: 32.23,14.55 32.23,15.16 33.93,16.86 47.27,16.86 47.82,17.41 57.61,17.41 58.54,18.34 70.23,18.34 71,19.12 73.9,19.12 79.33,24.55 79.33,25.3 81.28,27.25 v1(81.28,27.38)
  Bottom Layer w1: 30.21,14.55 32.23,14.55
G4: length 58.1
  Top Layer w0.3: U1.39 v1(82.04,26.62)
  Bottom Layer w0.3: v1(82.04,26.62) 81.91,26.49 81.09,26.49 79.74,25.13 79.74,24.38 74.07,18.71 71.17,18.71 70.39,17.94 58.7,17.94 57.77,17.01 47.99,17.01 47.44,16.46 39.75,16.46 38.28,14.99 38.28,14.55
G5: length 51.4
  Top Layer w0.3: 90.66,25.82 v1(81.28,25.82)
  Bottom Layer w0.3: 46.36,14.55 46.36,14.81 48.15,16.61 57.94,16.61 58.87,17.54 70.56,17.54 71.33,18.31 74.24,18.31 80.14,24.21 80.14,24.67 v1(81.28,25.82)
  Bottom Layer w1: 44.34,14.55 46.36,14.55
G6: length 42.8
  Top Layer w0.3: 90.66,25.02 v1(82.04,25.02)
  Bottom Layer w0.3: 52.41,14.55 54.06,16.2 58.11,16.2 59.04,17.13 70.73,17.13 71.5,17.91 74.4,17.91 80.65,24.15 80.65,24.46 81.2,25.02 v1(82.04,25.02)
G7: length 39.1
  Top Layer w0.3: U1.36 v1(81.28,24.22)
  Bottom Layer w0.3: 58.46,14.55 58.46,15.99 59.2,16.73 70.89,16.73 71.67,17.51 74.57,17.51 v1(81.28,24.22)
  Bottom Layer w1: 56.44,14.55 58.46,14.55
G8: length 30.2
  Top Layer w0.3: U1.35 v1(82.04,23.42)
  Bottom Layer w0.3: 64.52,14.55 64.52,15.19 65.66,16.33 71.06,16.33 71.83,17.11 74.74,17.11 81.05,23.42 v1(82.04,23.42)
G9: length 23.9
  Top Layer w0.3: U1.34 v1(81.28,22.62)
  Bottom Layer w0.3: v1(81.28,22.62) 80.81,22.62 74.9,16.7 72,16.7 70.57,15.27 70.57,14.55
G10: length 22.6
  Top Layer w0.3: 80.66,14.55 80.66,16.35 81.28,16.97 88.26,16.97 88.96,17.66 U1.33
  Bottom Layer w0.5: 74.61,14.55 74.61,15.63 75.18,16.2 80.14,16.2 80.66,15.68 80.66,14.55
I2C_SCL: length 32.3
  Top Layer w0.2: 33.78,29.86 33.78,27.38 34.24,26.92 58.93,26.92 60.21,25.64 U4.12
I2C_SDA: length 32.3
  Top Layer w0.2: U4.11 59.56,25.86 58.8,26.62 34.54,26.62 33.78,25.86 33.78,22.86
INT: length 38.9
  Top Layer w0.2: v1(30.48,27.76) 29.97,27.25 U5.10 ; U4.13 60.86,25.41 59.05,27.22 35.21,27.22 v1(34.67,27.76)
  Bottom Layer w0.2: v1(30.48,27.76) v1(34.67,27.76)
K1: length 127.5
  Top Layer w0.2: SW1.2 69.62,11.22 v1(69.22,11.63) ; U4.1 65.41,27.63 65.66,27.38 v1(65.79,27.38)
  Bottom Layer w0.2: v1(65.79,27.38) 65.59,27.58 62.42,27.58 60.69,25.86 60.69,24 59.44,22.75 54.87,22.75 53.98,21.86 43.44,21.86 42.43,20.84 35.82,20.84 34.55,19.57 16.9,19.57 15.3,17.97 15.3,12.91 16.39,11.82 24.61,11.82 26.67,9.76 28.83,9.76 31.19,12.12 68.72,12.12 v1(69.22,11.63)
K2: length 133
  Top Layer w0.2: v1(76.45,11.63) 76.61,11.48 SW2.2 ; U4.2 v1(64.76,27)
  Bottom Layer w0.2: v1(64.76,27) 64.56,27.2 62.47,27.2 61,25.73 61,23.87 59.57,22.44 55,22.44 54.11,21.56 43.57,21.56 42.55,20.54 35.95,20.54 34.68,19.27 17.02,19.27 15.6,17.85 15.6,13.03 16.52,12.12 24.74,12.12 26.8,10.06 28.7,10.06 31.06,12.42 75.91,12.42 76.45,11.89 v1(76.45,11.63)
K3: length 139.6
  Top Layer w0.2: SW3.2 84.36,10.97 v1(84.2,11.12) ; U4.3 v1(64.11,26.49)
  Bottom Layer w0.2: v1(84.2,11.12) 84.2,11.82 83.29,12.73 30.94,12.73 28.58,10.36 26.92,10.36 24.86,12.42 16.64,12.42 15.91,13.16 15.91,17.72 17.15,18.97 34.8,18.97 36.07,20.24 42.68,20.24 43.69,21.25 54.23,21.25 55.12,22.14 59.69,22.14 61.3,23.75 61.3,25.61 62.38,26.69 63.91,26.69 v1(64.11,26.49)
P1: length 65.3
  Top Layer w0.3: 22.14,14.55 22.14,15.36 23.27,16.49 28.93,16.49 29.52,17.08 35.22,17.08 35.95,17.81 42.31,17.81 42.97,18.47 48.38,18.47 49.34,19.42 58.93,19.42 59.74,20.22 65.71,20.22 67.45,21.96 74.35,21.96 74.87,22.48 74.87,25.43 78.46,29.02 79.26,29.02
P2: length 58.8
  Top Layer w0.3: U1.15 78.47,28.22 75.27,25.02 75.27,22.07 74.76,21.56 67.61,21.56 65.88,19.82 59.9,19.82 59.1,19.02 49.5,19.02 48.55,18.07 43.13,18.07 42.48,17.41 36.11,17.41 35.38,16.68 29.69,16.68 28.19,15.19 28.19,14.55
P3: length 52.4
  Top Layer w0.3: 34.25,14.55 34.42,14.72 34.42,15.15 36.28,17.01 42.64,17.01 43.3,17.66 48.72,17.66 49.67,18.62 59.27,18.62 60.07,19.42 66.04,19.42 67.78,21.15 75.26,21.15 75.67,21.57 75.67,24.57 78.52,27.42 U1.16
P4: length 50.2
  Top Layer w0.3: U1.17 78.55,26.62 76.07,24.15 76.07,21.12 75.71,20.75 67.95,20.75 66.21,19.02 60.24,19.02 59.43,18.21 49.83,18.21 48.88,17.26 43.47,17.26 42.81,16.61 37.61,16.61 36.45,15.44 36.45,14.74 36.27,14.55
P5: length 45.4
  Top Layer w0.3: 79.26,25.82 78.46,25.82 76.52,23.87 76.52,20.78 76.1,20.35 68.11,20.35 66.38,18.62 60.4,18.62 59.6,17.81 50,17.81 49.05,16.86 43.63,16.86 42.98,16.2 41.95,16.2 40.3,14.55
P6: length 43.4
  Top Layer w0.3: 42.32,14.55 42.32,14.98 43.8,16.46 49.22,16.46 50.17,17.41 59.76,17.41 60.57,18.21 66.54,18.21 68.28,19.95 76.46,19.95 76.92,20.41 76.92,23.59 78.35,25.02 79.26,25.02
P7: length 37.2
  Top Layer w0.3: 48.37,14.55 48.37,15.05 50.33,17.01 59.93,17.01 60.74,17.81 66.71,17.81 68.45,19.55 76.81,19.55 77.32,20.06 77.32,23.42 78.12,24.22 U1.20
P8: length 34.7
  Top Layer w0.3: U1.21 78.46,23.42 77.72,22.68 77.72,19.73 77.13,19.15 68.61,19.15 66.88,17.41 60.9,17.41 60.1,16.61 51.71,16.61 50.39,15.29 50.39,14.55
P9: length 30.1
  Top Layer w0.3: 54.43,14.55 54.43,15.01 55.63,16.2 60.26,16.2 61.07,17.01 67.04,17.01 68.78,18.74 77.3,18.74 78.08,19.53 79.01,19.53 79.26,19.78 U1.22
P10: length 24.4
  Top Layer w0.3: 60.48,14.55 60.48,15.85 61.23,16.61 67.21,16.61 68.94,18.34 77.47,18.34 78.25,19.12 79.46,19.12 80.11,19.78 80.66,19.78 80.96,20.08 U1.23
P11: length 23.3
  Top Layer w0.3: 62.5,14.55 62.5,15.84 62.87,16.2 67.38,16.2 69.11,17.94 77.63,17.94 78.42,18.72 79.62,18.72 80.28,19.38 81.41,19.38 81.76,19.73 U1.24
P12: length 19.8
  Top Layer w0.3: U1.25 82.56,19.14 82.4,18.98 80.45,18.98 79.79,18.32 78.58,18.32 77.8,17.54 69.28,17.54 66.53,14.79 66.53,14.55
P13: length 19.4
  Top Layer w0.3: U1.26 83.36,19.05 82.89,18.57 80.61,18.57 79.96,17.92 78.75,17.92 77.97,17.14 69.64,17.14 68.55,16.05 68.55,14.55
P14: length 16.2
  Top Layer w0.3: U1.27 84.16,18.58 83.76,18.17 80.78,18.17 80.12,17.52 78.91,17.52 78.13,16.73 73.68,16.73 72.59,15.64 72.59,14.55
P15: length 13.3
  Top Layer w0.3: 76.62,14.55 76.62,15.74 77.22,16.33 78.3,16.33 79.08,17.11 80.29,17.11 80.95,17.77 84.62,17.77 84.96,18.11 U1.28
P16: length 12.4
  Top Layer w0.3: 78.64,14.55 78.64,16.11 79.25,16.71 80.46,16.71 81.11,17.37 85.24,17.37 85.76,17.89 U1.29
PA3_TX: length 15.8
  Top Layer w0.2: TX.1 73.03,30.83 73.03,27.38 70.48,24.84 65.53,24.84 64.76,24.07 U4.19
PA4_RX: length 11.7
  Top Layer w0.2: U4.20 65.41,23.95 65.91,24.46 70.61,24.46 74.16,28 RX.1
PC0-RST: length 3.6
  Top Layer w0.2: U4.4 63.46,32.34 63.46,32.34
PWM: length 119.4
  Top Layer w0.2: U4.14 61.51,21.45 61.26,21.2 59.82,21.2 59.6,21.21 58.47,20.07 49.06,20.07 48.11,19.12 ; R1.1 56.81,11.72 55.98,12.55 16.97,12.55 16.31,11.89 9.35,11.89 8.51,12.73 8.51,16.82 10.16,18.47 42.04,18.47 42.7,19.12 48.11,19.12
STB: length 29
  Top Layer w0.2: 82.56,32.32 82.56,33.21 82.04,33.73 80.22,33.73 77.12,30.63 77.12,29.33 73.82,26.03 73.82,23.19 73.62,22.98 66.89,22.98 65.41,21.51 63.78,21.51 63.46,21.83 U4.17
SWC: length 8.6
  Top Layer w0.2: U4.18 64.11,24.84 65.6,26.34 TP4.1
SWD: length 12.3
  Top Layer w0.2: U4.8 60.86,27.51 60.48,27.13 v1(60.32,27.13) ; TP4.2 70.04,28.14 v1(66.8,28.14)
  Bottom Layer w0.2: v1(66.8,28.14) 65.28,28.14 65.02,27.88 62.29,27.88 61.54,27.13 v1(60.32,27.13)
VH: length 71
  Top Layer w0.4: U1.30 86.56,21.86 86.87,22.17 89.29,22.17 90.68,20.78 90.68,14.05 89.79,13.16 v3(89.79,9.73)
  Bottom Layer w0.4: v3(38.99,10.23) 45.47,10.23 48.26,7.44 89.03,7.44 89.79,8.2 v3(89.79,9.73)
W_DIN: length 127.9
  Top Layer w0.2: v1(62.16,25.22) U4.6 ; U6.4 84.82,15.18 v1(84.84,15.19)
  Bottom Layer w0.2: v1(84.84,15.19) 84.84,14.55 83.31,13.03 16.89,13.03 16.51,13.41 16.51,17.47 17.4,18.36 35.05,18.36 36.32,19.63 42.93,19.63 43.94,20.65 54.48,20.65 55.37,21.54 59.94,21.54 62.16,23.75 v1(62.16,25.22)
$1N1295: length 10.7
  Top Layer w0.2: 93.22,31.69 93.22,33.6 93.09,33.73 85.98,33.73 85.76,33.51 85.76,32.32
$1N1298: length 8
  Top Layer w0.3: 51.08,8.33 51.02,8.39 51.02,9.83 ; 51.02,9.83 R3.1 49.5,9.85 D1.1 ; 51.02,9.83 R5.2
$1N1312: length 4.9
  Top Layer w0.25: 50.2,1.54 51.05,1.54 52.34,2.83 52.81,2.83 ; 54.44,3.66 54.44,3.22 54.23,3.02 53.16,3.02
$1N1316: length 2.9
  Top Layer w0.5: 39.89,3.03 39.89,4.29 41.05,5.45 41.07,5.45
$1N1320: length 1.9
  Top Layer w0.5: 39.25,5.4 39.2,5.45 37.4,5.45
$1N1321: length 6.1
  Top Layer w0.5: 35.17,0.59 30.22,0.59 29.68,1.13 29.68,1.47
$1N1324: length 14.5
  Top Layer w0.2: 33.65,6.46 33.66,6.47 v1(33.66,7.44)
  Bottom Layer w0.25: v1(43.89,6.3) 42.24,4.65 34.04,4.65 33.66,5.03 v1(33.66,7.44)
$1N1595: length 3.3
  Top Layer w0.3: 31.71,5.82 C9.2 ; 31.71,5.82 R11.2 ; 31.71,5.82 31.68,5.8 U3.4
$2N726: length 9
  Top Layer w0.2: USB1.A5 14.74,4.02 14.48,3.76 9.65,3.76 9.15,3.26 8.25,3.26
$2N727: length 8.7
  Top Layer w0.2: R13.2 21.39,3.07 20.7,3.76 16.13,3.76 15.74,4.15 USB1.B5
$2N1396: length 8.6
  Top Layer w0.4: D4.3 25.52,30.56 C11.2 25.57,28.6 26.29,27.89 27.94,27.89 28.7,28.65 U5.6
$2N1576: length 70.6
  Top Layer w0.2: U7.4 14.73,13.65 14.73,13.03 15.11,12.65 16.13,12.65 16.64,13.16 81.35,13.16 81.86,12.65 82.99,12.65 83.12,12.78 U6.2

## Copper pours and planes (outline as drawn; the poured copper is in the pictures)
GND on Top Layer: -1.4,36.52 101.35,36.52 101.35,-1.83 -1.4,-1.83
GND on Bottom Layer: -1.4,36.52 101.35,36.52 101.35,-1.83 -1.4,-1.83
VCC on Top Layer: 5.78,8.94 30.28,8.94 30.28,3.1 5.78,3.1
F1 on Top Layer: 47.16,8.78 50.01,8.78 50.01,7.87 47.16,7.87
F2 on Top Layer: 52.14,8.77 53.05,8.77 53.05,5.72 52.14,5.72
VH on Top Layer: 36.18,10.72 41.74,10.72 41.74,9.01 36.18,9.01
VH on Top Layer: 36.19,10.33 37.65,10.33 37.65,7.64 36.19,7.64
$1N1304 on Top Layer: 47.22,6.04 48.55,6.04 48.55,3.18 47.22,3.18
$1N1305 on Top Layer: 49.42,7.14 50.86,7.14 50.86,3.16 49.42,3.16
$1N1316 on Top Layer: 36.93,4.34 40.24,4.34 40.24,2.91 36.93,2.91
$1N1320 on Top Layer: 34.89,6.04 36.24,6.04 36.24,3.48 34.89,3.48
$1N1321 on Top Layer: 25.56,2.33 30.08,2.33 30.08,1.08 25.56,1.08
$1N1321 on Top Layer: 34.87,2.33 38.3,2.33 38.3,0.34 34.87,0.34
$1N1324 on Top Layer: 42.88,8.42 44.26,8.42 44.26,5.01 42.88,5.01
$2N1397 on Top Layer: 20.61,30 22.82,30 22.82,27.1 20.61,27.1

Small or netless copper shapes (teardrops, artwork), in the pictures only: 165 on Top Layer, 65 on Bottom Layer

## Text on the board
Top Silkscreen Layer: JLCJLCJLCJLC | K1 | K2 | K3
